# Altium schematic sheet EN-C200_RA0_OLED.SchDoc
size A4
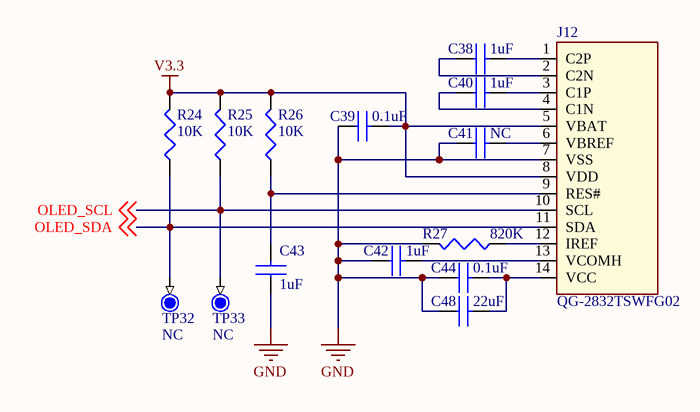
[diagram p0: EN-C200_RA0_OLED.SchDoc]

## Parts
C38  1uF  [SC0603]
C39  0.1uF  [SC0603]
C40  1uF  [SC0603]
C41  NC  [SC0603]
C42  1uF  [SC0603]
C43  1uF  [SC0603]
C44  0.1uF  [SC0603]
C48  22uF  [SC0805]
J12  QG-2832TSWFG02  [FPC14-25]
R24  10K  [SR0603]
R25  10K  [SR0603]
R26  10K  [SR0603]
R27  820K  [SR0603]
TP32  NC  [TP32-SMD]
TP33  NC  [TP32-SMD]

## Nets
GND: C39.1 C41.1 C42.1 C43.1 C44.1 C48.1 J12.7(VSS) R27.2
V3.3: C39.2 J12.5(VBAT) J12.8(VDD) R24.2 R25.2 R26.2
OLED_SCL: J12.10(SCL) R25.1 TP33.1 ; off-sheet OLED_SCL
OLED_SDA: J12.11(SDA) R24.1 TP32.1 ; off-sheet OLED_SDA
NetC38_1: C38.1 J12.2(C2N)
NetC38_2: C38.2 J12.1(C2P)
NetC40_1: C40.1 J12.4(C1N)
NetC40_2: C40.2 J12.3(C1P)
NetC41_2: C41.2 J12.6(VBREF)
NetC42_2: C42.2 J12.13(VCOMH)
NetC43_2: C43.2 J12.9(RES#) R26.1
NetC44_2: C44.2 C48.2 J12.14(VCC)
NetJ12_12: J12.12(IREF) R27.1

## Library data of the parts
C38-C44 C48 = CAP NP
J12 = OLED_0.91
R24-R27 = RESISTOR
TP32 TP33 = TP